# Altium schematic sheet KDWM1000_Sch.SchDoc: KDWM1000
size 304 x 203 mm; Author: Hom; CompanyName: KitSprout; DrawnBy: Hom; Engineer: Hom; Organization: KitSprout; Revision: A; SheetNumber: 1; SheetTotal: 1; Version: 1.4; LibVersion: 2.5; PageSetup: Record=PageOptions|CenterHorizontal=True|CenterVertical=True|PrintScale=1.00|XCorrection=1.00|YCorrection=1.00|PrintKind=0|BorderSize=5000000|LeftOffset=0|BottomOffset=0|Orientation=2|PaperLength=1000|PaperWidth=1000|Scale=100|PaperSource=7|PrintQuality=-3|MediaType=1|DitherType=10|PrintScaleMode=0|PaperKind=A3|PaperIndex=8
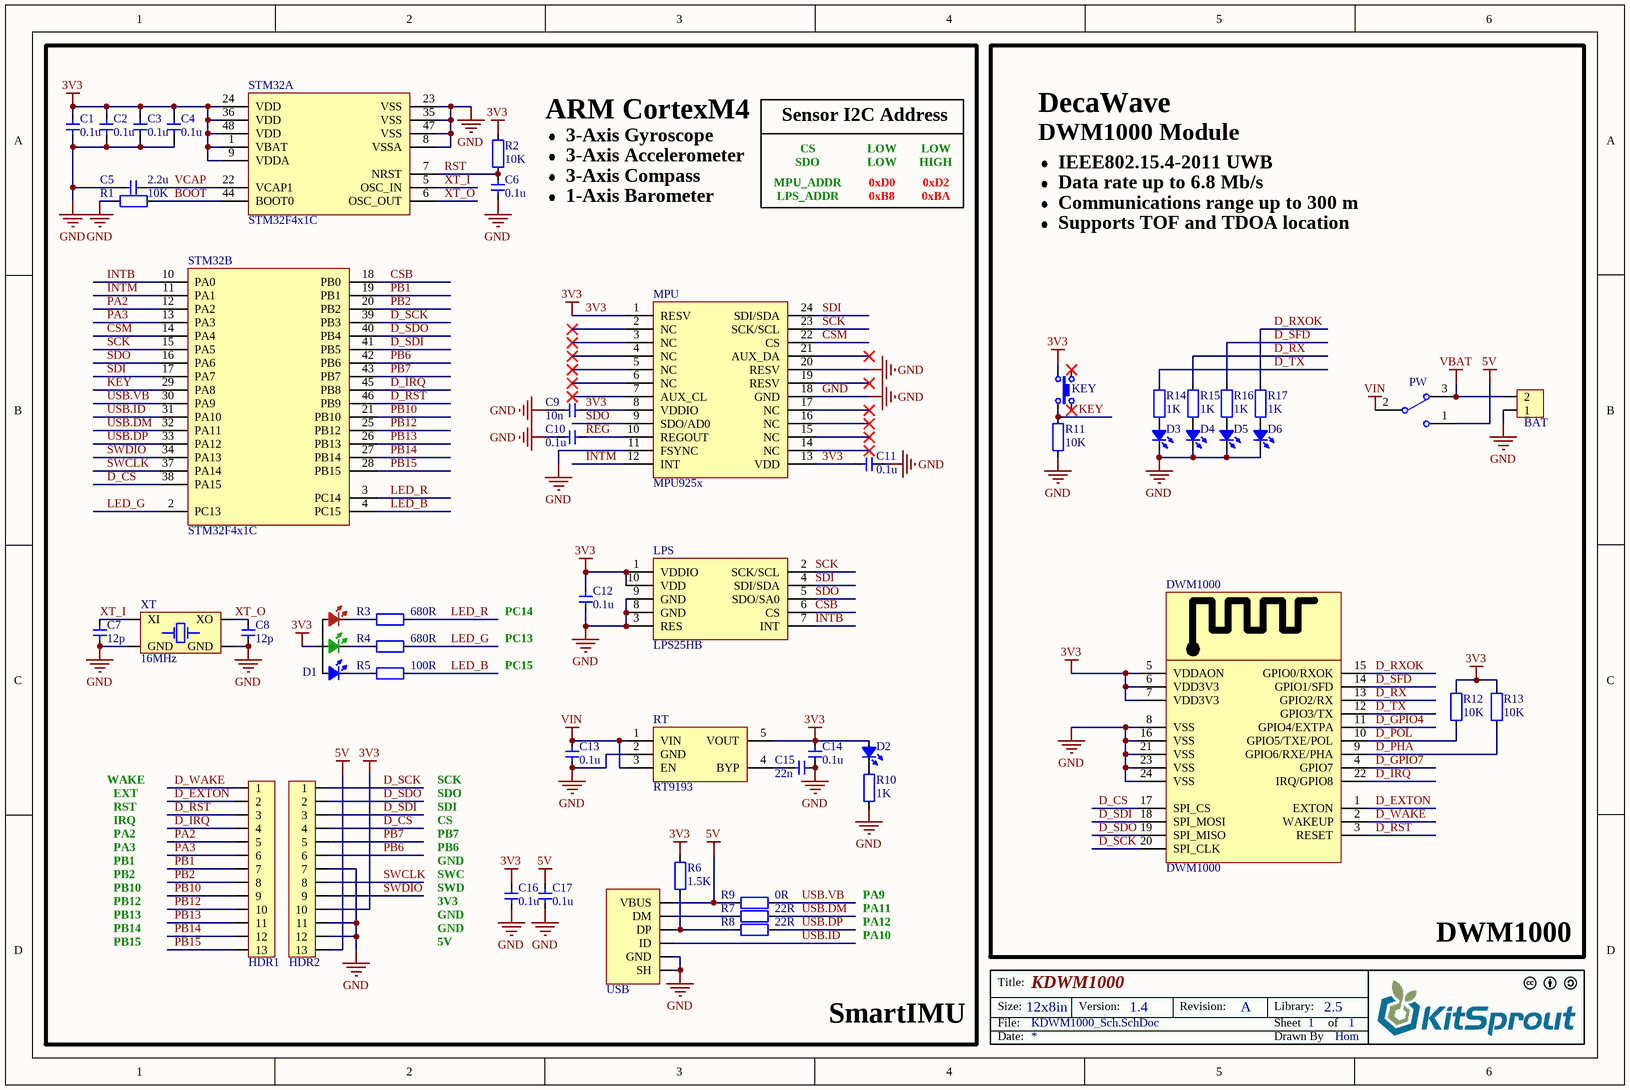
[diagram p0: KDWM1000_Sch.SchDoc]

## Parts
BAT  HDR1x2_2.54  [HDR1X2_2.54_180HD]  (value not drawn)
C1  value 0.1u  [CAP_0402]  (hidden comment: Cap_0402)
C2  value 0.1u  [CAP_0402]  (hidden comment: Cap_0402)
C3  value 0.1u  [CAP_0402]  (hidden comment: Cap_0402)
C4  value 0.1u  [CAP_0402]  (hidden comment: Cap_0402)
C5  value 2.2u  [CAP_0402]  (hidden comment: Cap_0402)
C6  value 0.1u  [CAP_0402]  (hidden comment: Cap_0402)
C7  value 12p  [CAP_0402]  (hidden comment: Cap_0402)
C8  value 12p  [CAP_0402]  (hidden comment: Cap_0402)
C9  value 10n  [CAP_0402]  (hidden comment: Cap_0402)
C10  value 0.1u  [CAP_0402]  (hidden comment: Cap_0402)
C11  value 0.1u  [CAP_0402]  (hidden comment: Cap_0402)
C12  value 0.1u  [CAP_0402]  (hidden comment: Cap_0402)
C13  value 0.1u  [CAP_0603]  (hidden comment: Cap_0603)
C14  value 0.1u  [CAP_0603]  (hidden comment: Cap_0603)
C15  value 22n  [CAP_0603]  (hidden comment: Cap_0603)
C16  value 0.1u  [CAP_0603]  (hidden comment: Cap_0603)
C17  value 0.1u  [CAP_0603]  (hidden comment: Cap_0603)
D1  LED_1616_RGB  [LED_1616_RGB]  (value not drawn)
D2  LED_0603  [LED_0603_YELLOW]  (value not drawn)
D3  LED_0603  [LED_0603_YELLOW]  (value not drawn)
D4  LED_0603  [LED_0603_YELLOW]  (value not drawn)
D5  LED_0603  [LED_0603_RED]  (value not drawn)
D6  LED_0603  [LED_0603_GREEN]  (value not drawn)
DWM1000  DWM1000  [DWM1000]
HDR1  HDR1x13_2.54  [HDR1X13_2.54_180]  (value not drawn)
HDR2  HDR1x13_2.54T  [HDR1X13_2.54_180]  (value not drawn)
KEY  ButtonTACT  [ButtonTACT_3.5*3.55_90]  (value not drawn)
LPS  LPS25HB  [HCLGA-2.5x2.5_10]
MPU  MPU925x  [QFN_P0.4_24]
PW  SwitchSPDT_2.8x6.6_90  [SwitchSPDT_2.8X6.6_90]  (value not drawn)
R1  value 10K  [RES_0402]  (hidden comment: Res_0402)
R2  value 10K  [RES_0402]  (hidden comment: Res_0402)
R3  value 680R  [RES_0402]  (hidden comment: Res_0402)
R4  value 680R  [RES_0402]  (hidden comment: Res_0402)
R5  value 100R  [RES_0402]  (hidden comment: Res_0402)
R6  value 1.5K  [RES_0603]  (hidden comment: Res_0603)
R7  value 22R  [RES_0603]  (hidden comment: Res_0603)
R8  value 22R  [RES_0603]  (hidden comment: Res_0603)
R9  value 0R  [RES_0603]  (hidden comment: Res_0603)
R10  value 1K  [RES_0603]  (hidden comment: Res_0603)
R11  value 10K  [RES_0603]  (hidden comment: Res_0603)
R12  value 10K  [RES_0603]  (hidden comment: Res_0603)
R13  value 10K  [RES_0603]  (hidden comment: Res_0603)
R14  value 1K  [RES_0603]  (hidden comment: Res_0603)
R15  value 1K  [RES_0603]  (hidden comment: Res_0603)
R16  value 1K  [RES_0603]  (hidden comment: Res_0603)
R17  value 1K  [RES_0603]  (hidden comment: Res_0603)
RT  RT9193  [SOT23-5]
STM32  STM32F4x1C  [QFN_P0.5_48]  (parts A,B of 2)
USB  USB_Micro  [USB_Micro-AB]  (value not drawn)
XT  value 16MHz  [XT_2520_4]  (hidden comment: XTAL_2520_4P)

## Nets
3V3: C1.2 C2.2 C3.2 C4.2 C9.1 C11.2 C12.1 C14.2 C16.1 D1.4(A) D2.1(A) DWM1000.5(VDDAON) DWM1000.6(VDD3V3) DWM1000.7(VDD3V3) HDR2.10 KEY.3 LPS.1(VDDIO) LPS.10(VDD) MPU.1(RESV) MPU.8(VDDIO) MPU.13(VDD) R2.2 R6.1 R12.2 R13.2 RT.5(VOUT) STM32.1(VBAT) STM32.9(VDDA) STM32.24(VDD) STM32.36(VDD) STM32.48(VDD)
5V: C17.1 HDR2.13 PW.1 R9.2 USB.1(VBUS)
GND: BAT.1 C1.1 C2.1 C3.1 C4.1 C5.1 C6.2 C7.1 C8.1 C9.2 C10.2 C11.1 C12.2 C13.1 C14.1 C15.1 C16.2 C17.2 D3.2(K) D4.2(K) D5.2(K) D6.2(K) DWM1000.8(VSS) DWM1000.16(VSS) DWM1000.21(VSS) DWM1000.23(VSS) DWM1000.24(VSS) HDR2.7 HDR2.11 HDR2.12 LPS.3(RES) LPS.8(GND) LPS.9(GND) MPU.11(FSYNC) MPU.18(GND) MPU.20(RESV) R1.1 R10.1 R11.1 RT.2(GND) STM32.8(VSSA) STM32.23(VSS) STM32.35(VSS) STM32.47(VSS) USB.0(SH) USB.5(GND) XT.2(GND) XT.4(GND)
VBAT: BAT.2 PW.3
VIN: C13.2 PW.2 RT.1(VIN) RT.3(EN)
BOOT: R1.2 STM32.44(BOOT0)
CSB: LPS.6(CS) STM32.18(PB0)
CSM: MPU.22(CS) STM32.14(PA4)
D_CS: DWM1000.17(SPI_CS) HDR2.4 STM32.38(PA15)
D_EXTON: DWM1000.1(EXTON) HDR1.2
D_GPIO4: DWM1000.11(GPIO4/EXTPA)
D_GPIO7: DWM1000.4(GPIO7)
D_IRQ: DWM1000.22(IRQ/GPIO8) HDR1.4 STM32.45(PB8)
D_PHA: DWM1000.9(GPIO6/RXE/PHA) R13.1
D_POL: DWM1000.10(GPIO5/TXE/POL) R12.1
D_RST: DWM1000.3(RESET) HDR1.3 STM32.46(PB9)
D_RX: DWM1000.13(GPIO2/RX) R15.2
D_RXOK: DWM1000.15(GPIO0/RXOK) R17.2
D_SCK: DWM1000.20(SPI_CLK) HDR2.1 STM32.39(PB3)
D_SDI: DWM1000.18(SPI_MOSI) HDR2.3 STM32.41(PB5)
D_SDO: DWM1000.19(SPI_MISO) HDR2.2 STM32.40(PB4)
D_SFD: DWM1000.14(GPIO1/SFD) R16.2
D_TX: DWM1000.12(GPIO3/TX) R14.2
D_WAKE: DWM1000.2(WAKEUP) HDR1.1
INTB: LPS.7(INT) STM32.10(PA0)
INTM: MPU.12(INT) STM32.11(PA1)
KEY: KEY.4 R11.2 STM32.29(PA8)
LED_B: R5.1 STM32.4(PC15)
LED_G: R4.1 STM32.2(PC13)
LED_R: R3.1 STM32.3(PC14)
PA2: HDR1.5 STM32.12(PA2)
PA3: HDR1.6 STM32.13(PA3)
PB1: HDR1.7 STM32.19(PB1)
PB2: HDR1.8 STM32.20(PB2)
PB6: HDR2.6 STM32.42(PB6)
PB7: HDR2.5 STM32.43(PB7)
PB10: HDR1.9 STM32.21(PB10)
PB12: HDR1.10 STM32.25(PB12)
PB13: HDR1.11 STM32.26(PB13)
PB14: HDR1.12 STM32.27(PB14)
PB15: HDR1.13 STM32.28(PB15)
REG: C10.1 MPU.10(REGOUT)
RST: C6.1 R2.1 STM32.7(NRST)
SCK: LPS.2(SCK/SCL) MPU.23(SCK/SCL) STM32.15(PA5)
SDI: LPS.4(SDI/SDA) MPU.24(SDI/SDA) STM32.17(PA7)
SDO: LPS.5(SDO/SA0) MPU.9(SDO/AD0) STM32.16(PA6)
SWCLK: HDR2.8 STM32.37(PA14)
SWDIO: HDR2.9 STM32.34(PA13)
USB.DM: R7.2 STM32.32(PA11)
USB.DP: R8.2 STM32.33(PA12)
USB.ID: STM32.31(PA10) USB.4(ID)
USB.VB: R9.1 STM32.30(PA9)
VCAP: C5.2 STM32.22(VCAP1)
XT_I: C7.2 STM32.5(OSC_IN) XT.1(XI)
XT_O: C8.2 STM32.6(OSC_OUT) XT.3(XO)
NetC15_2: C15.2 RT.4(BYP)
NetD1_1: D1.1(R) R3.2
NetD1_2: D1.2(G) R4.2
NetD1_3: D1.3(B) R5.2
NetD2_2: D2.2(K) R10.2
NetD3_1: D3.1(A) R14.1
NetD4_1: D4.1(A) R15.1
NetD5_1: D5.1(A) R16.1
NetD6_1: D6.1(A) R17.1
NetR6_2: R6.2 R8.1 USB.3(DP)
NetR7_1: R7.1 USB.2(DM)

Not connected (* = marked no-connect by the designer): KEY 1* 2*; MPU 2(NC)* 3(NC)* 4(NC)* 5(NC)* 6(NC)* 7(AUX_CL)* 14(NC)* 15(NC)* 16(NC)* 17(NC)* 19(RESV)* 21(AUX_DA)*

## Notes on the sheet
- ARM CortexM4
- 3-Axis Gyroscope
- 3-Axis Accelerometer
- CS
  SDO
- Sensor I2C Address
- LOW
  LOW
- LOW
  HIGH
- DecaWave
- DWM1000 Module
- IEEE802.15.4-2011 UWB
- 3-Axis Compass
- 1-Axis Barometer
- MPU_ADDR
  LPS_ADDR
- 0xD0
  0xB8
- 0xD2
  0xBA
- Data rate up to 6.8 Mb/s
- Communications range up to 300 m
- Supports TOF and TDOA location
- PC14
- PC15
- PC13
- WAKE
- EXT
- IRQ
- PA2
- RST
- SCK
- SDO
- SDI
- CS
- PB7
- PA3
- PB12
- PB1
- PB2
- PB10
- PB6
- SWD
- SWC
- 3V3
- GND
- PA9
- PB15
- PB14
- PB13
- 5V
- PA10
- PA11
- PA12
- DWM1000
- SmartIMU
- Title:
- Size:
- Date:
- File:
- 12x8in
- Version:
- Revision:
- Sheet
- Drawn By
- Library:
- of

## Library data of the parts
BAT = HDR1x2_2.54T: Header
C1-C12 = Cap_0402: Capacitor
C13-C17 = Cap_0603: Capacitor
D1 = LED_1616_RGB: LED
D2-D6 = LED_0603: LED
DWM1000 = DWM1000: Module; Manufacturer: Decawave Limited; Frequency: 3.5GHz ~ 6.5GHz; Data Rate: 6.8Mbps; Serial Interfaces: SPI; Antenna Type: Integrated, Chip; Voltage - Supply: 2.8 V ~ 3.6 V; Current - Receiving: 64mA; Current - Transmitting: 31mA; Supplier 1: Digi-Key; Manufacturer Part Number: DWM1000; RoHS: RoHS Compliant; Category: RF/IF and RFID; Stock 1: 1028; Pricing 1: 1=32.16, 10=26.704, 100=24.24, 250=22.51296 (USD); Packaging: Cut Tape (CT); RF Family/Standard: 802.15.4; Protocol: -; Modulation: -; Power - Output: -; Sensitivity: -; Memory Size: -; Mounting Type: Surface Mount; Operating Temperature: -40°C ~ 85°C; Package / Case: Module; ComponentLink1URL: http://www.decawave.com/sites/default/files/product-pdf/dwm1000-product-brief.pdf; ComponentLink1Description: http://www.decawave.com/sites/default/files/product-pdf/dwm1000-product-brief.pdf; Supplier Part Number 1: 1479-1002-1-ND
HDR1 = HDR1x13_2.54: Header
HDR2 = HDR1x13_2.54T: Header
KEY = ButtonTACT: Button
LPS = LPS25Hx: Sensor Pressure
MPU = MPU925x: Sensor Motion
PW = SwitchSPDT_2.8x6.6_90: Switch
R1-R5 = Res_0402: Resistor
R6-R17 = Res_0603: Resistor
RT = RT9193: Power
STM32 = STM32F4x1C: MCU
USB = USB_Micro: USB
XT = XTAL_2520_4P: Crystal Oscillator